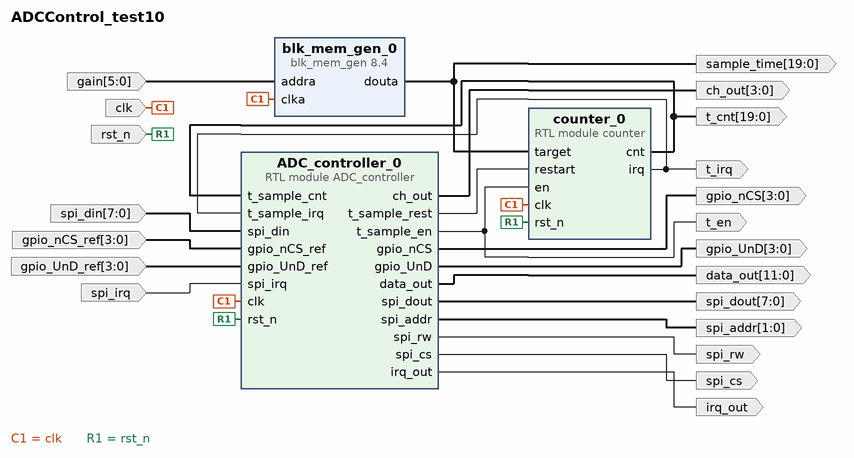
[diagram p0: block diagram of the top level]
# Vivado block design ADCControl_test10, xczu3eg-sbva484-1-i, Vivado 2020.2
create_bd_design ADCControl_test10

create_bd_port -dir I -from 5 -to 0 gain
create_bd_port -dir I -type clk clk
create_bd_port -dir I -type rst rst_n
create_bd_port -dir O spi_rw
create_bd_port -dir O -from 7 -to 0 spi_dout
create_bd_port -dir O -from 1 -to 0 spi_addr
create_bd_port -dir O spi_cs
create_bd_port -dir O -from 3 -to 0 gpio_UnD
create_bd_port -dir O -from 3 -to 0 gpio_nCS
create_bd_port -dir I -from 7 -to 0 spi_din
create_bd_port -dir O -from 3 -to 0 ch_out
create_bd_port -dir O -from 11 -to 0 data_out
create_bd_port -dir I -from 3 -to 0 gpio_nCS_ref
create_bd_port -dir I -from 3 -to 0 gpio_UnD_ref
create_bd_port -dir O irq_out
create_bd_port -dir O -from 19 -to 0 sample_time
create_bd_port -dir O -from 19 -to 0 t_cnt
create_bd_port -dir O t_irq
create_bd_port -dir O t_en
create_bd_port -dir I spi_irq

create_bd_cell -type ip -vlnv xilinx.com:ip:blk_mem_gen:8.4 blk_mem_gen_0
set_property -dict [list \
  CONFIG.Coe_File ../../../../../../../../src/sample_time_lut_data.coe \
  CONFIG.Enable_32bit_Address false \
  CONFIG.Enable_A Always_Enabled \
  CONFIG.Fill_Remaining_Memory_Locations false \
  CONFIG.Load_Init_File true \
  CONFIG.Memory_Type Single_Port_ROM \
  CONFIG.Port_A_Write_Rate 0 \
  CONFIG.Register_PortA_Output_of_Memory_Core false \
  CONFIG.Register_PortA_Output_of_Memory_Primitives true \
  CONFIG.Use_RSTA_Pin false \
  CONFIG.Write_Depth_A 64 \
  CONFIG.Write_Width_A 20 \
  CONFIG.use_bram_block Stand_Alone \
] [get_bd_cells blk_mem_gen_0]
create_bd_cell -type module -reference counter counter_0
set_property -dict {CONFIG.auto_rst {"1"} CONFIG.n_bits 20} [get_bd_cells counter_0]
create_bd_cell -type module -reference ADC_controller ADC_controller_0

# ---- connections ----

connect_bd_net -net addra_0_1 [get_bd_ports gain] [get_bd_pins blk_mem_gen_0/addra]
connect_bd_net -net clka_0_1 [get_bd_ports clk] [get_bd_pins blk_mem_gen_0/clka] [get_bd_pins counter_0/clk] [get_bd_pins ADC_controller_0/clk]
connect_bd_net [get_bd_pins blk_mem_gen_0/douta] [get_bd_ports sample_time] [get_bd_pins counter_0/target]
connect_bd_net -net rst_n_0_1 [get_bd_ports rst_n] [get_bd_pins counter_0/rst_n] [get_bd_pins ADC_controller_0/rst_n]
connect_bd_net [get_bd_pins ADC_controller_0/spi_rw] [get_bd_ports spi_rw]
connect_bd_net [get_bd_pins ADC_controller_0/spi_dout] [get_bd_ports spi_dout]
connect_bd_net [get_bd_pins ADC_controller_0/spi_addr] [get_bd_ports spi_addr]
connect_bd_net [get_bd_pins ADC_controller_0/spi_cs] [get_bd_ports spi_cs]
connect_bd_net [get_bd_pins ADC_controller_0/gpio_UnD] [get_bd_ports gpio_UnD]
connect_bd_net [get_bd_pins ADC_controller_0/gpio_nCS] [get_bd_ports gpio_nCS]
connect_bd_net [get_bd_pins ADC_controller_0/t_sample_rest] [get_bd_pins counter_0/restart]
connect_bd_net [get_bd_pins ADC_controller_0/t_sample_en] [get_bd_ports t_en] [get_bd_pins counter_0/en]
connect_bd_net [get_bd_pins counter_0/cnt] [get_bd_ports t_cnt] [get_bd_pins ADC_controller_0/t_sample_cnt]
connect_bd_net [get_bd_pins counter_0/irq] [get_bd_ports t_irq] [get_bd_pins ADC_controller_0/t_sample_irq]
connect_bd_net -net spi_din_0_1 [get_bd_ports spi_din] [get_bd_pins ADC_controller_0/spi_din]
connect_bd_net [get_bd_pins ADC_controller_0/ch_out] [get_bd_ports ch_out]
connect_bd_net [get_bd_pins ADC_controller_0/data_out] [get_bd_ports data_out]
connect_bd_net -net gpio_nCS_ref_0_1 [get_bd_ports gpio_nCS_ref] [get_bd_pins ADC_controller_0/gpio_nCS_ref]
connect_bd_net -net gpio_UnD_ref_0_1 [get_bd_ports gpio_UnD_ref] [get_bd_pins ADC_controller_0/gpio_UnD_ref]
connect_bd_net [get_bd_pins ADC_controller_0/irq_out] [get_bd_ports irq_out]
connect_bd_net -net spi_irq_0_1 [get_bd_ports spi_irq] [get_bd_pins ADC_controller_0/spi_irq]

validate_bd_design
save_bd_design
